# EAGLE board moteus_n1 (EAGLE 9.6.0)
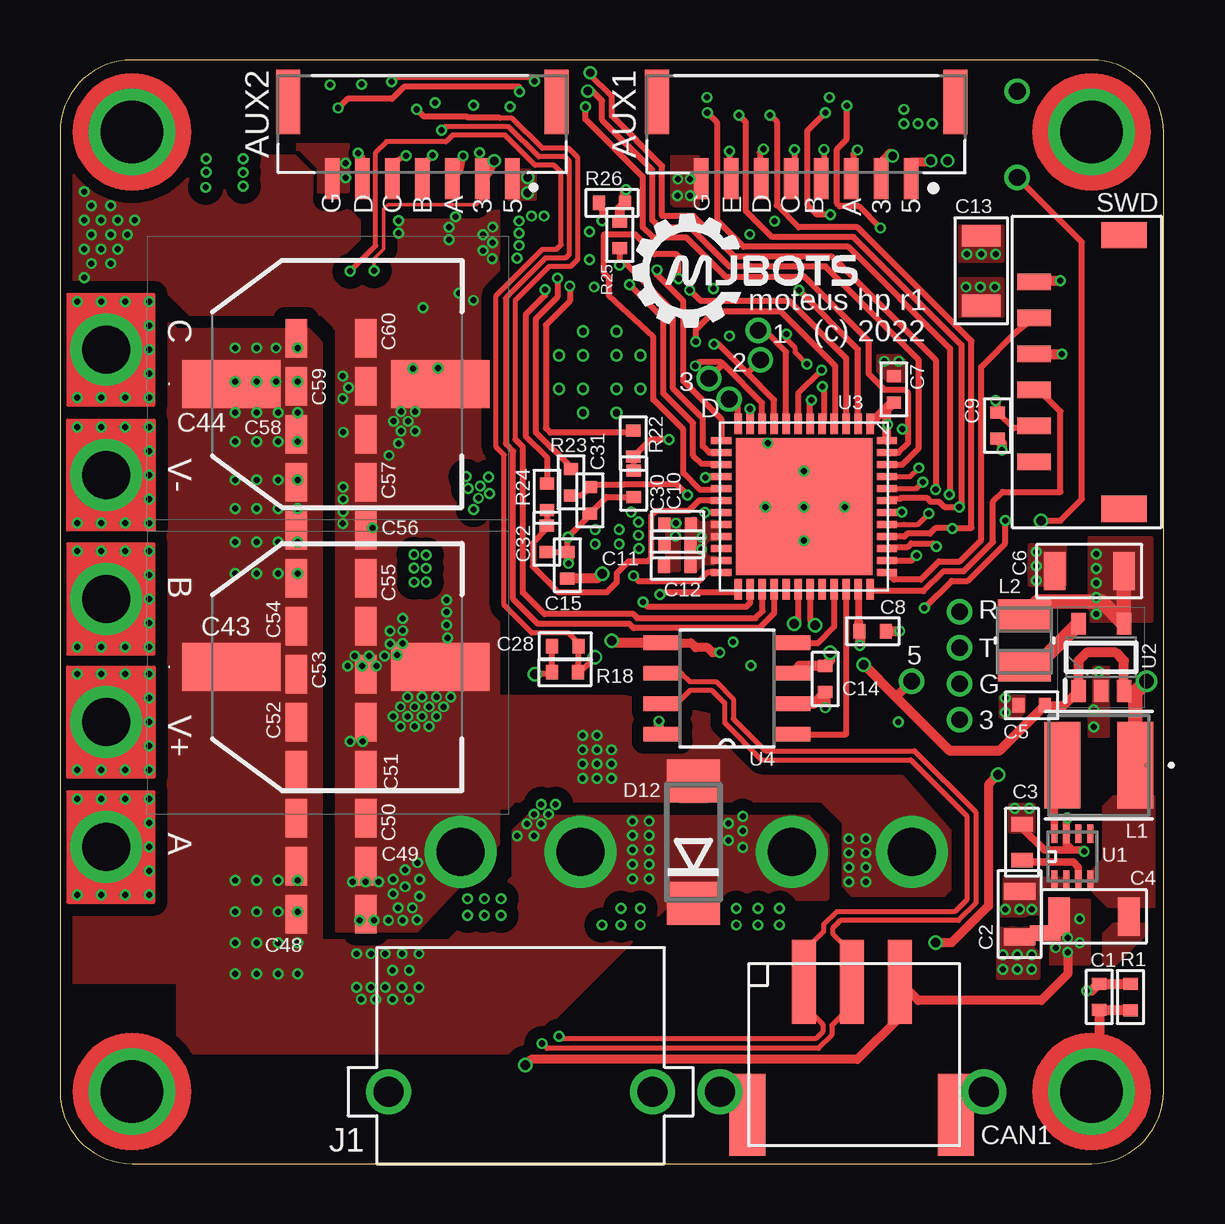
[diagram p9: board, top side]
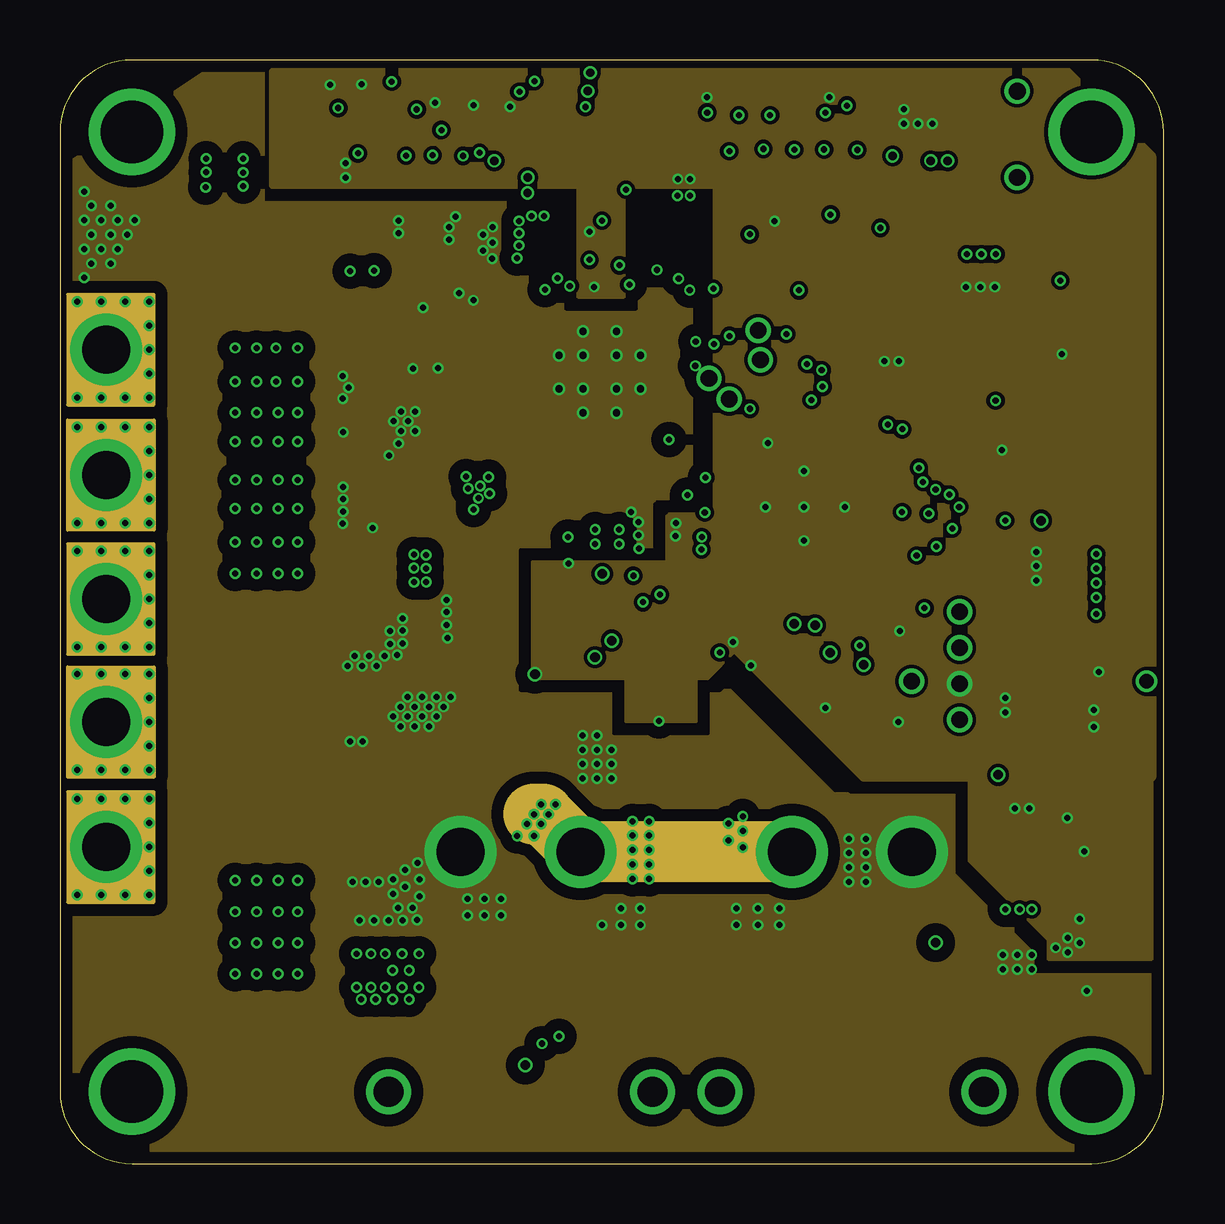
[diagram p10: board, inner layer Route2]
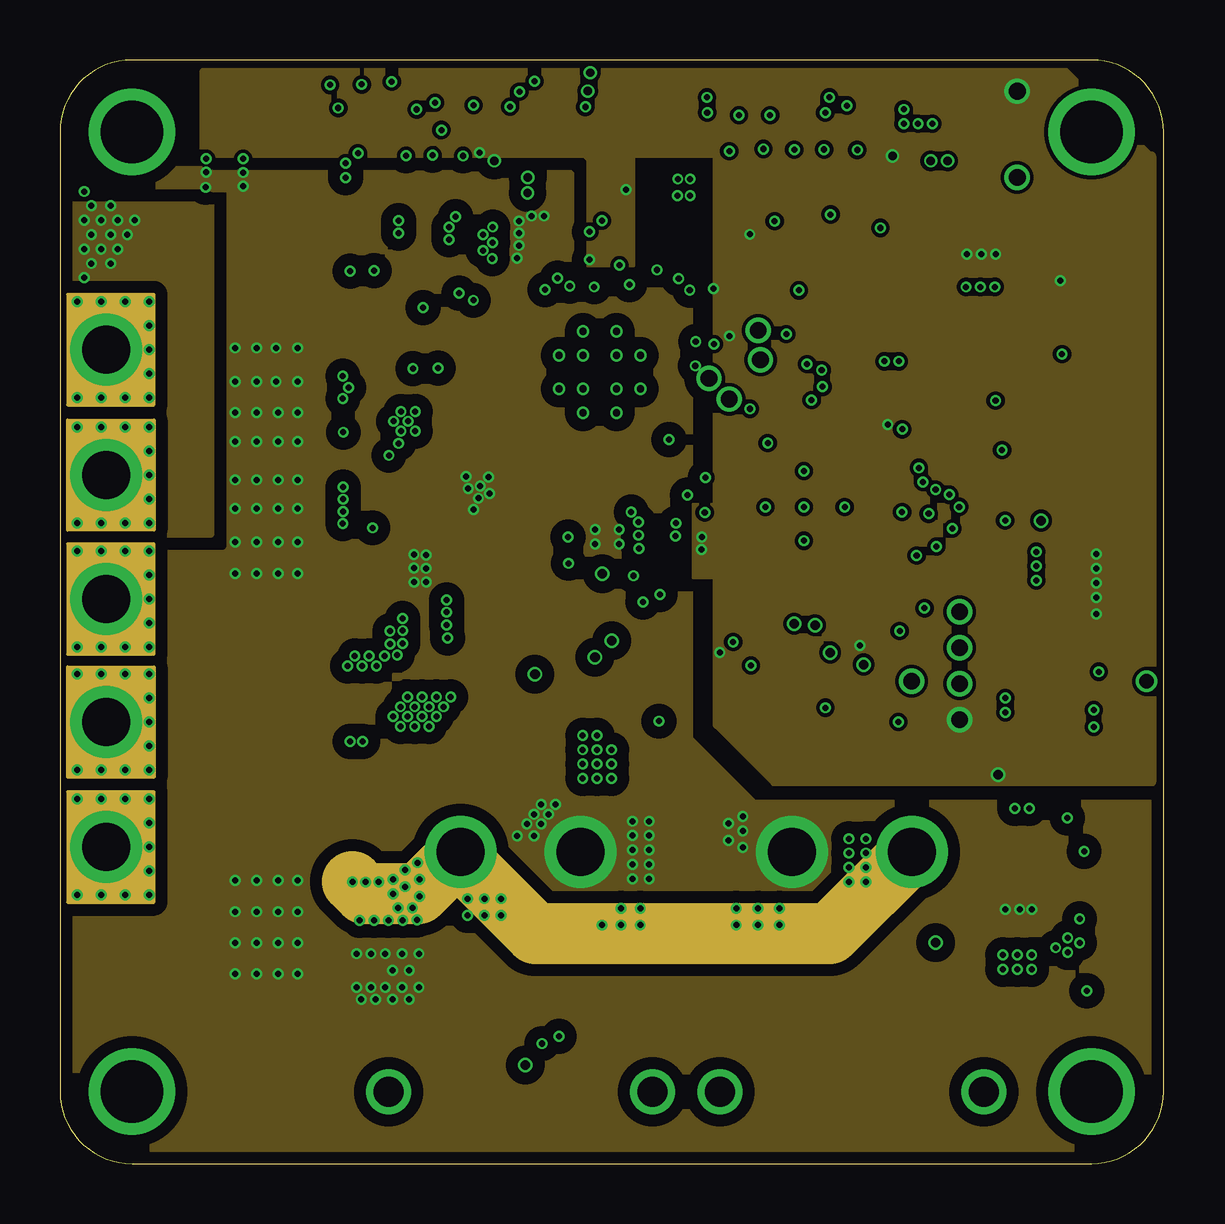
[diagram p11: board, inner layer Route15]
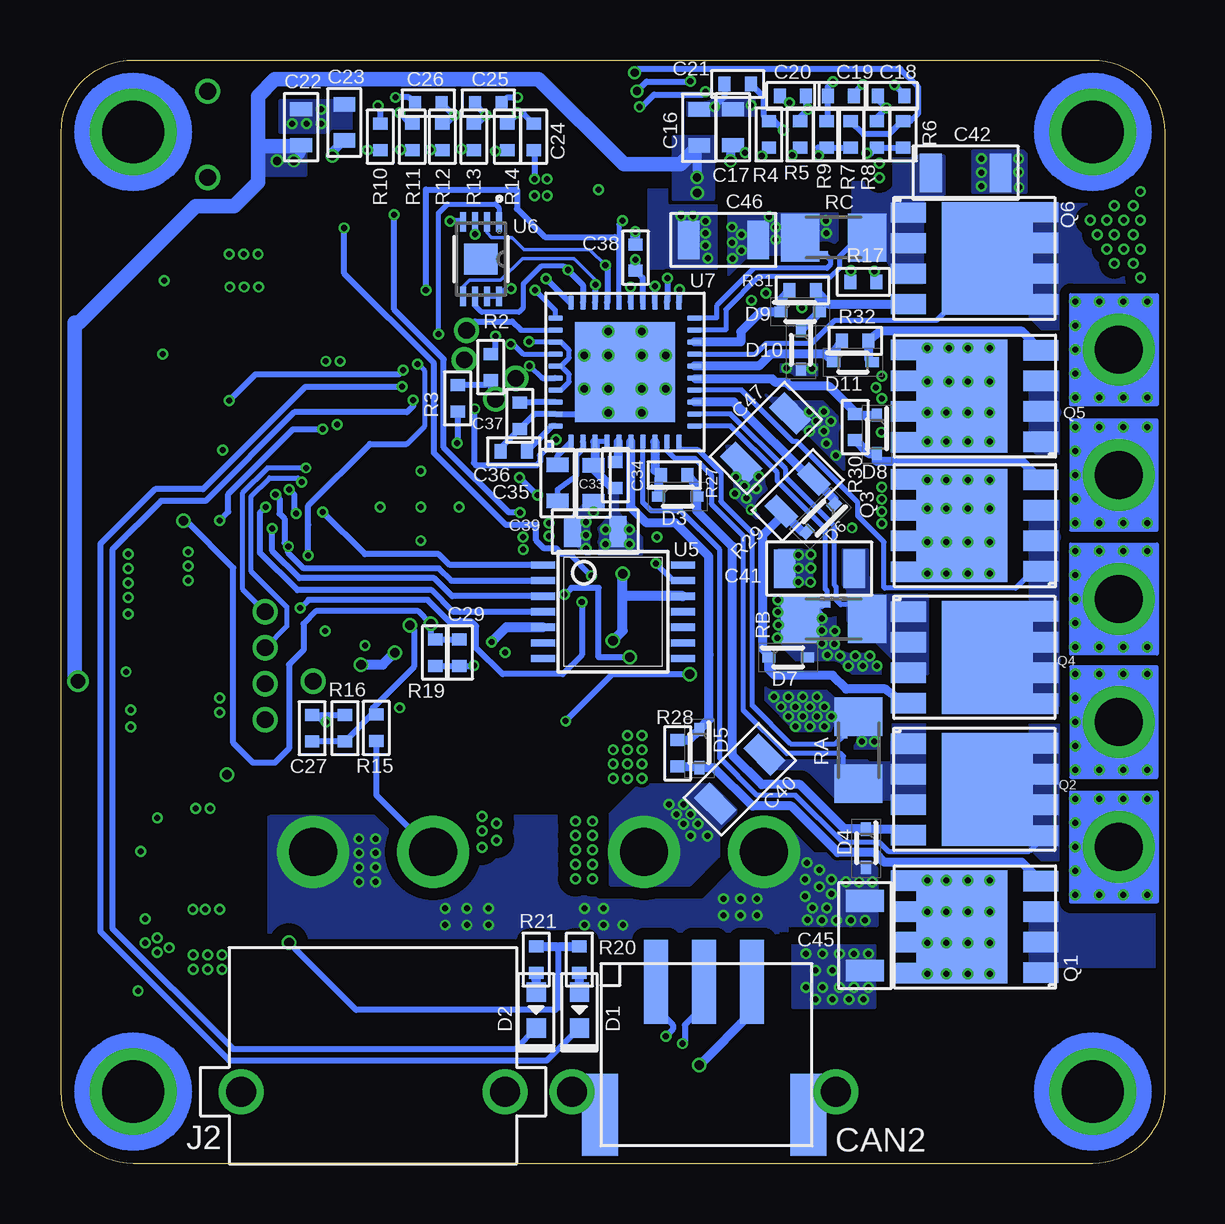
[diagram p12: board, bottom side, seen from below]

Size 46 x 46 mm. Coordinates in mm from the lower left corner, seen from the top.
Outline: 0,43 0,3 arc90 3,0 43,0 arc90 46,3 46,43 arc90 43,46 3,46 arc90 0,43
Copper layers (1*2*15*16): Top 0.035mm / dielectric 0.23mm / Route2 0.035mm / dielectric 0.93mm / Route15 0.035mm / dielectric 0.23mm / Bottom 0.035mm
Design rules "MF_4_mil_drill_4_Layer *": minimum track width 5mil, minimum drill 4mil, track to track 6mil, track to pad 6mil, pad to pad 6mil, via to via 6mil, smd to smd 0mil, copper to edge 10mil, drill to drill 10mil, minimum pad ring 4mil, minimum via ring 4mil, stop-mask expansion 2mil, vias tented up to drill 25mil, thermal gap 10mil
Net classes: 0 default: width 0.127 mm; 1 CAN: width 0.216 mm, clearance 0.127 mm; 2 HV: clearance 0.13 mm; 3 GATE: width 0.384 mm

## Footprints (pad centres in the part's own frame; a part is rotated, then mirrored left to right if it is on the bottom)
16AWG_TERM = drill 2: 1 0,0 | drill 0.254: 2 -2,1.8; 3 -2,0.8; 4 -2,-0.2; 5 -2,-1.2; 6 -1,1.8; 7 2,1.8; 8 1,1.8; 9 2,0.8; 10 2,-0.2; 11 2,-1.2; 12 0,1.8
JST_SM08B-GHS-TB(LF)(SN) = smd 0.6 x 1.7: 1 -4.375,0; 2 -3.125,0; 3 -1.875,0; 4 -0.625,0; 5 0.625,0; 6 1.875,0; 7 3.125,0; 8 4.375,0 | smd 1 x 2.7: SH1 -6.225,-3.2; SH2 6.225,-3.2
JST_SM07B-GHS-TB(LF)(SN) = smd 0.6 x 1.7: 1 -3.75,1.85; 2 -2.5,1.85; 3 -1.25,1.85; 4 0,1.85; 5 1.25,1.85; 6 2.5,1.85; 7 3.75,1.85 | smd 1 x 2.7: S1 5.6,-1.35; S2 -5.6,-1.35
C0402 = smd 0.5 x 0.6: P$1 -0.55,0; P$2 0.55,0
C0805 = smd 0.7 x 1.3: P$1 -0.95,0; P$2 0.95,0
C0603 = smd 0.6 x 0.9: P$1 -0.75,0; P$2 0.75,0
C1206 = smd 0.9 x 1.6: P$1 -1.45,0; P$2 1.45,0
EEHZS1V471UP = smd 4.1 x 2: 1 -4.35,0; 2 4.35,0
C1206_NOCREAM_NOBORDER = smd 0.9 x 1.6: P$1 -1.45,0; P$2 1.45,0
JST_S3B-PH-SM4-TB(LF)(SN) = smd 1 x 3.5: 1 2,-2.98; 2 0,-2.98; 3 -2,-2.98 | smd 1.5 x 3.4: S1 -4.35,2.57; S2 4.35,2.57
LED0603 = smd 0.8 x 0.8: ANODE 0.75,0; CATHODE -0.75,0
SODFL1608X70N = smd 0.55 x 0.42: 1 -0.8,0; 2 0.8,0
DO214AA = smd 1.8 x 2.2: A 2.55,0; C -2.55,0
24AWG_PAD = drill 0.7: P$1 0,0
XT30PW_MALE = drill 2: 1 -2.5,0; 2 2.5,0 | drill 1.25: M1 -5.5,10; M2 5.5,10
IND_BOURNS_SRN4018 = smd 1.499 x 3.607: 1 -1.524,0; 2 1.524,0
IND_4024100_WRE = smd 1.295 x 2.21: 1 -1.054,0; 2 1.054,0
M2.5MOUNT = drill 2.6: P$1 0,0
SOP_ADVANCE_8_VIAS = smd 0.85 x 1.45: 1 -1.905,-2.95; 2 -0.635,-2.95; 3 0.635,-2.95; 4 1.905,-2.95 | smd 0.85 x 1.1: 5 1.925,2.75; 6 0.637,2.75; 7 -0.637,2.75; 8 -1.925,2.75 | smd 4.7 x 3.8: PAD 0,0.35
SOP_ADVANCE_8 = smd 0.85 x 1.45: 1 -1.905,-2.95; 2 -0.635,-2.95; 3 0.635,-2.95; 4 1.905,-2.95 | smd 0.85 x 1.1: 5 1.925,2.75; 6 0.637,2.75; 7 -0.637,2.75; 8 -1.925,2.75 | smd 4.7 x 3.8: PAD 0,0.35
R0402 = smd 0.5 x 0.6: P$1 -0.55,0; P$2 0.55,0
R0805 = smd 0.7 x 1.3: P$1 -0.95,0; P$2 0.95,0
M1206 = smd 1.6 x 2: 1 -1.4,0; 2 1.4,0
SHORT_TOP-50 = smd 0.254 x 0.254: 1 0.127,0; 2 -0.127,0
SHORT_TOP-MEDIUM = smd 0.635 x 0.635: 1 0.318,0; 2 -0.318,0
JST_S6B-ZR-SM4A-TF(LF)(SN) = smd 0.7 x 1.4: 1 3.75,0; 2 2.25,0; 3 0.75,0; 4 -0.75,0; 5 -2.25,0; 6 -3.75,0 | smd 1.1 x 1.9: P1 5.7,3.75; P2 -5.7,3.75
21-0487A_MXM = smd 0.762 x 0.254: 1 -0.953,0.75; 2 -0.953,0.25; 3 -0.953,-0.25; 4 -0.953,-0.75; 5 0.953,-0.75; 6 0.953,-0.25; 7 0.953,0.25; 8 0.953,0.75
SOT95P280X130-5N = smd 0.9 x 0.6: 1 -1.4,0.95; 2 -1.4,0; 3 -1.4,-0.95; 4 1.4,-0.95; 5 1.4,0.95
QFN50P700X700X60-49N = smd 0.85 x 0.3: 1 -3.45,2.75; 2 -3.45,2.25; 3 -3.45,1.75; 4 -3.45,1.25; 5 -3.45,0.75; 6 -3.45,0.25; 7 -3.45,-0.25; 8 -3.45,-0.75; 9 -3.45,-1.25; 10 -3.45,-1.75; 11 -3.45,-2.25; 12 -3.45,-2.75; 25 3.45,-2.75; 26 3.45,-2.25; 27 3.45,-1.75; 28 3.45,-1.25; 29 3.45,-0.75; 30 3.45,-0.25; 31 3.45,0.25; 32 3.45,0.75; 33 3.45,1.25; 34 3.45,1.75; 35 3.45,2.25; 36 3.45,2.75 | smd 0.3 x 0.85: 13 -2.75,-3.45; 14 -2.25,-3.45; 15 -1.75,-3.45; 16 -1.25,-3.45; 17 -0.75,-3.45; 18 -0.25,-3.45; 19 0.25,-3.45; 20 0.75,-3.45; 21 1.25,-3.45; 22 1.75,-3.45; 23 2.25,-3.45; 24 2.75,-3.45; 37 2.75,3.45; 38 2.25,3.45; 39 1.75,3.45; 40 1.25,3.45; 41 0.75,3.45; 42 0.25,3.45; 43 -0.25,3.45; 44 -0.75,3.45; 45 -1.25,3.45; 46 -1.75,3.45; 47 -2.25,3.45; 48 -2.75,3.45 | smd 5.7 x 5.7: 49 0,0
SOIC8 = smd 1.549 x 0.61: 1 -2.7,1.905; 2 -2.7,0.635; 3 -2.7,-0.635; 4 -2.7,-1.905; 5 2.7,-1.905; 6 2.7,-0.635; 7 2.7,0.635; 8 2.7,1.905
TSSOP14 = smd 0.305 x 0.991: 1 -1.95,-2.918; 2 -1.3,-2.918; 3 -0.65,-2.918; 4 0,-2.918; 5 0.65,-2.918; 6 1.3,-2.918; 7 1.95,-2.918; 8 1.95,2.918; 9 1.3,2.918; 10 0.65,2.918; 11 0,2.918; 12 -0.65,2.918; 13 -1.3,2.918; 14 -1.95,2.918
UDFN8_2X3_ONS-M = smd 0.813 x 0.254: 1 -1.549,0.75; 2 -1.549,0.25; 3 -1.549,-0.25; 4 -1.549,-0.75; 5 1.549,-0.75; 6 1.549,-0.25; 7 1.549,0.25; 8 1.549,0.75 | smd 1.295 x 1.397: 9 0,0
WQFN-40 = smd 0.22 x 0.6: 1 2.25,2.9; 2 1.75,2.9; 3 1.25,2.9; 4 0.75,2.9; 5 0.25,2.9; 6 -0.25,2.9; 7 -0.75,2.9; 8 -1.25,2.9; 9 -1.75,2.9; 10 -2.25,2.9; 21 -2.25,-2.9; 22 -1.75,-2.9; 23 -1.25,-2.9; 24 -0.75,-2.9; 25 -0.25,-2.9; 26 0.25,-2.9; 27 0.75,-2.9; 28 1.25,-2.9; 29 1.75,-2.9; 30 2.25,-2.9 | smd 0.6 x 0.22: 11 -2.9,2.25; 12 -2.9,1.75; 13 -2.9,1.25; 14 -2.9,0.75; 15 -2.9,0.25; 16 -2.9,-0.25; 17 -2.9,-0.75; 18 -2.9,-1.25; 19 -2.9,-1.75; 20 -2.9,-2.25; 31 2.9,-2.25; 32 2.9,-1.75; 33 2.9,-1.25; 34 2.9,-0.75; 35 2.9,-0.25; 36 2.9,0.25; 37 2.9,0.75; 38 2.9,1.25; 39 2.9,1.75; 40 2.9,2.25 | drill 0.305: P1 -0.7,-1.7; P2 0.7,-1.7; P3 1.7,-0.7; P7 0.7,-0.7; P8 0.7,1.7; P9 -0.7,1.7; P12 -0.7,-0.7; P13 0.7,0.7; P14 -0.7,0.7; P17 -1.7,-0.7; P18 1.7,0.7; P19 -1.7,0.7 | smd 4.15 x 4.15: PAD 0,0

## Placement (x,y rotation side)
A  PAD16AWG_TERM  [16AWG_TERM]  1.92,13.19 90 bottom
AUX1  SM08B-GHS-TB(LF)(SN)  [JST_SM08B-GHS-TB(LF)(SN)]  31.1,41.05 180 top
AUX2  SM07B-GHS-TB(LF)(SN)  [JST_SM07B-GHS-TB(LF)(SN)]  15.1,42.9 180 top
B  PAD16AWG_TERM  [16AWG_TERM]  1.92,23.53 90 bottom
C  PAD16AWG_TERM  [16AWG_TERM]  1.92,33.92 90 bottom
C1  DNP  [C0402]  43.32,6.95 90 top
C2  1uF 100V  [C0805]  40,10.4 270 top
C3  1uF  [C0603]  40.1,13.4 90 top
C4  10uF  [C1206]  43.1,10.3 180 top
C5  1uF  [C0402]  40.5,19.1 180 top
C6  22uF  [C1206]  42.9,24.7 180 top
C7  0.1uF  [C0402]  34.76,32.27 90 top
C8  0.1uF  [C0402]  33.88,22.19 0 top
C9  0.1uF  [C0402]  39.08,30.76 270 top
C10  1uF  [C0402]  25.75,26.62 180 top
C11  0.1uF  [C0402]  25.74,25.82 180 top
C12  0.1uF  [C0402]  25.73,24.92 180 top
C13  10uF  [C1206]  38.4,37.21 90 top
C14  0.1uF  [C0402]  31.9,20.2 270 top
C15  0.1uF  [C0402]  21.15,24.94 90 top
C16  1uF  [C0603]  19.41,43.18 90 bottom
C17  1uF  [C0603]  18,43.2 90 bottom
C18  DNP  [C0402]  11.4,44.5 0 bottom
C19  DNP  [C0402]  13.5,44.5 0 bottom
C20  DNP  [C0402]  15.5,44.5 180 bottom
C21  DNP  [C0402]  17.8,45 180 bottom
C22  1uF  [C0603]  36,43.2 90 bottom
C23  1uF  [C0603]  34.2,43.4 90 bottom
C24  DNP  [C0402]  26.3,42.8 270 bottom
C25  DNP  [C0402]  28.2,44.2 0 bottom
C26  DNP  [C0402]  30.7,44.2 180 bottom
C27  0.01uF  [C0402]  35.54,18.15 90 bottom
C28  0.1uF  [C0402]  21.06,21.56 180 top
C29  0.1uF  [C0402]  29.4,21.3 270 bottom
C30  1000pF  [C0402]  23.91,28.34 270 top
C31  1000pF  [C0402]  22.09,27.65 270 top
C32  1000pF  [C0402]  20.29,26.04 270 top
C33  0.1uF 100V  [C0603]  23.81,28.35 270 bottom
C34  1uF  [C0402]  22.9,28.7 90 bottom
C35  0.1uF 100V  [C0603]  25.31,28.37 90 bottom
C36  1uF  [C0402]  27.13,29.69 0 bottom
C37  1uF  [C0402]  26.89,31.17 90 bottom
C38  0.1uF  [C0402]  22.06,37.76 270 bottom
C39  0.47uF 100V  [C0805]  23.74,26.34 180 bottom
C40  0.1uF 100V  [C1206]  17.71,16.02 45 bottom
C41  0.1uF 100V  [C1206]  14.4,24.8 0 bottom
C42  0.1uF 100V  [C1206]  8.3,41.3 180 bottom
C43  100uF 63V  [EEHZS1V471UP]  11.5,20.7 0 top
C44  100uF 63V  [EEHZS1V471UP]  11.5,32.5 0 top
C45  4.7uF 100V  [C1206]  12.5,9.5 90 bottom
C46  4.7uF 100V  [C1206]  18.4,38.5 0 bottom
C47  4.7uF 100V  [C1206]  16.63,30.24 45 bottom
C48  4.7uF 100V  [C1206_NOCREAM_NOBORDER]  11.3,10.4 0 top
C49  4.7uF 100V  [C1206_NOCREAM_NOBORDER]  11.3,12.4 0 top
C50  4.7uF 100V  [C1206_NOCREAM_NOBORDER]  11.3,14.4 0 top
C51  4.7uF 100V  [C1206_NOCREAM_NOBORDER]  11.3,16.4 0 top
C52  4.7uF 100V  [C1206_NOCREAM_NOBORDER]  11.3,18.4 0 top
C53  4.7uF 100V  [C1206_NOCREAM_NOBORDER]  11.3,20.4 0 top
C54  4.7uF 100V  [C1206_NOCREAM_NOBORDER]  11.3,22.4 0 top
C55  4.7uF 100V  [C1206_NOCREAM_NOBORDER]  11.3,24.4 0 top
C56  4.7uF 100V  [C1206_NOCREAM_NOBORDER]  11.3,26.4 0 top
C57  4.7uF 100V  [C1206_NOCREAM_NOBORDER]  11.3,28.4 0 top
C58  4.7uF 100V  [C1206_NOCREAM_NOBORDER]  11.3,30.4 0 top
C59  4.7uF 100V  [C1206_NOCREAM_NOBORDER]  11.3,32.4 0 top
C60  4.7uF 100V  [C1206_NOCREAM_NOBORDER]  11.3,34.4 0 top
CAN1  JST-PH3  [JST_S3B-PH-SM4-TB(LF)(SN)]  33,4.6 180 top
CAN2  JST-PH3  [JST_S3B-PH-SM4-TB(LF)(SN)]  19.2,4.6 180 bottom
D1  MF-LED-0603-RED  [LED0603]  24.4,6.4 90 bottom
D2  MF-LED-0603-RED  [LED0603]  26.2,6.4 90 bottom
D3  BAT41KFILM  [SODFL1608X70N]  20.3,27.8 0 bottom
D4  BAT41KFILM  [SODFL1608X70N]  12.45,13.14 270 bottom
D5  BAT41KFILM  [SODFL1608X70N]  19.4,17.3 270 bottom
D6  BAT41KFILM  [SODFL1608X70N]  14.35,26.9 225 bottom
D7  BAT41KFILM  [SODFL1608X70N]  15.7,21.1 0 bottom
D8  BAT41KFILM  [SODFL1608X70N]  12,30.4 270 bottom
D9  BAT41KFILM  [SODFL1608X70N]  15.2,35.5 0 bottom
D10  BAT41KFILM  [SODFL1608X70N]  15.17,33.92 270 bottom
D11  BAT41KFILM  [SODFL1608X70N]  13,33.4 0 bottom
D12  [DO214AA]  26.4,13.4 90 top
D33  PAD24AWG_PAD  [24AWG_PAD]  37.5,18.5 0 top
D50  PAD24AWG_PAD  [24AWG_PAD]  35.5,20.1 0 top
DAC  PAD24AWG_PAD  [24AWG_PAD]  27.9,31.86 0 top
DG1  PAD24AWG_PAD  [24AWG_PAD]  37.5,20 0 top
DTR  PAD24AWG_PAD  [24AWG_PAD]  37.5,23 0 top
DTX  PAD24AWG_PAD  [24AWG_PAD]  37.5,21.5 0 top
J1  XT30XT30PW_MALE  [XT30PW_MALE]  19.2,13 180 top
J2  XT30XT30PW_MALE  [XT30PW_MALE]  33,13 180 bottom
L1  SRN4018-220M  [IND_BOURNS_SRN4018]  43.3,16.6 180 top
L2  74404024100  [IND_4024100_WRE]  40.2,21.8 270 top
M1  MOUNT  [M2.5MOUNT]  3,3 0 top
M2  MOUNT  [M2.5MOUNT]  3,43 0 top
M3  MOUNT  [M2.5MOUNT]  43,3 0 top
M4  MOUNT  [M2.5MOUNT]  43,43 0 top
MOT1  PAD24AWG_PAD  [24AWG_PAD]  29.1,34.73 0 top
MOT2  PAD24AWG_PAD  [24AWG_PAD]  29.2,33.5 0 top
MOT3  PAD24AWG_PAD  [24AWG_PAD]  27.05,32.73 0 top
Q1  TPH1R204PL_VIAS  [SOP_ADVANCE_8_VIAS]  8.11,9.86 90 bottom
Q2  TPH1R204PLSOP_ADVANCE_8  [SOP_ADVANCE_8]  7.74,15.6 270 bottom
Q3  TPH1R204PL_VIAS  [SOP_ADVANCE_8_VIAS]  8.11,26.59 90 bottom
Q4  TPH1R204PLSOP_ADVANCE_8  [SOP_ADVANCE_8]  7.74,21.1 270 bottom
Q5  TPH1R204PL_VIAS  [SOP_ADVANCE_8_VIAS]  8.11,31.99 90 bottom
Q6  TPH1R204PLSOP_ADVANCE_8  [SOP_ADVANCE_8]  7.74,37.73 270 bottom
R1  DNP  [R0402]  44.62,6.94 90 top
R2  DNP  [R0402]  28.1,33.2 90 bottom
R3  100k 1%  [R0402]  29.47,31.9 90 bottom
R4  100  [R0402]  16.5,42.9 90 bottom
R5  100  [R0402]  15.2,42.9 90 bottom
R6  2k  [R0402]  10.9,42.9 270 bottom
R7  2k  [R0402]  13.1,42.9 270 bottom
R8  100  [R0402]  12,42.9 90 bottom
R9  100  [R0402]  14.1,42.9 90 bottom
R10  100  [R0402]  32.7,42.8 90 bottom
R11  100  [R0402]  31.37,42.8 90 bottom
R12  100  [R0402]  30.11,42.8 90 bottom
R13  100  [R0402]  28.8,42.8 90 bottom
R14  100  [R0402]  27.4,42.8 90 bottom
R15  100k 1%  [R0402]  32.87,18.16 270 bottom
R16  4.7k 1%  [R0402]  34.17,18.15 270 bottom
R17  47k NTC  [R0402]  12.56,36.75 0 bottom
R18  10k 1%  [R0402]  21.05,20.48 180 top
R19  10k 1%  [R0402]  30.4,21.3 270 bottom
R20  560  [R0402]  24.4,8.5 270 bottom
R21  560  [R0402]  26.2,8.5 270 bottom
R22  22  [R0402]  23.9,30.01 270 top
R23  22  [R0402]  21.3,28.4 270 top
R24  22  [R0402]  20.3,27.79 270 top
R25  2k  [R0402]  23.34,38.71 270 top
R26  2k  [R0402]  23.01,40.04 180 top
R27  7.5  [R0402]  20.45,28.7 0 bottom
R28  7.5  [R0402]  20.3,17.1 270 bottom
R29  7.5  [R0805]  15.3,27.86 225 bottom
R30  7.5  [R0402]  12.9,30.7 270 bottom
R31  7.5  [R0402]  15.1,36.4 0 bottom
R32  7.5  [R0402]  12.9,34.3 0 bottom
RA  0.5mOhm 1% 2W  [M1206]  12.76,17.23 270 bottom
RB  0.5mOhm 1% 2W  [M1206]  13.8,22.7 0 bottom
RC  0.5mOhm 1% 2W  [M1206]  13.8,38.6 0 bottom
SH1  SHORTT5  [SHORT_TOP-50]  13.36,17.98 270 bottom
SH2  SHORTT5  [SHORT_TOP-50]  14.2,23.3 0 bottom
SH3  SHORTT5  [SHORT_TOP-50]  14.3,37.9 0 bottom
SH4  SHORTMEDIUM  [SHORT_TOP-MEDIUM]  41.06,9.6 180 top
SWD  JST-ZH6  [JST_S6B-ZR-SM4A-TF(LF)(SN)]  40.6,33 270 top
TEMP1  PAD24AWG_PAD  [24AWG_PAD]  39.9,44.7 0 top
TEMP2  PAD24AWG_PAD  [24AWG_PAD]  39.9,41.1 0 top
U1  MAX15062AATA+T  [21-0487A_MXM]  42.2,12.8 90 top
U2  XC9265A331MR-G  [SOT95P280X130-5N]  43.4,21.1 90 top
U3  STM32G474CEU6  [QFN50P700X700X60-49N]  31.02,27.38 270 top
U4  TCAN1042HGV  [SOIC8]  27.8,19.8 180 top
U5  AS5147  [TSSOP14]  23,23 270 bottom
U6  CAT25080HU4I-GT3UDFN8_2X3_ONS-M  [UDFN8_2X3_ONS-M]  28.5,37.7 270 bottom
U7  DRV8353S  [WQFN-40]  22.5,32.99 180 bottom
VN  PAD16AWG_TERM  [16AWG_TERM]  1.92,28.7 270 top
VP  PAD16AWG_TERM  [16AWG_TERM]  1.92,18.4 270 top

## Tracks (layer width: path | path; a pad name or v marks a point on that pad's centre or on a via)
+3V3  (via drill 0.25, 0.35, 0.4)
  Top 0.152: AUX2.2 17.6,40.2 17.37,39.97 13.67,39.97 13.49,39.79 13.49,38.12 13.09,37.72 v13.09,37.22
  Top 0.254: U3.35 33.29,23.93
  Top 0.3: 33.29,23.93 33.29,22.57
  Top 0.35: U3.48 34.47,30.77
  Top 0.384: U3.1 34.66,31.72 C7.P$1 34.47,31.43 U3.48 | 33.29,22.57 C8.P$1 | v34.7,42 34.58,42.1 34.23,41.7 AUX1.2 | v18.1,41.8 17.81,41.26 AUX2.2 | v39.1,16.2 38.7,15.8 38.7,10.74 37.16,9.2 v36.5,9.2 | U4.5 26.3,21.7 26.5,21.5 27,21.5 27.2,21.3 v27.5,21.3
  Top 0.406: C8.P$1 v33.34,21.6 | SWD.6 40.65,36.8 v41.7,36.8 | 34.47,30.77 v34.5,30.8 | v23.6,40.6 23.56,40.56 R26.P$1 23.34,39.82 R25.P$1 | U4.5 23.09,21.7 v23,21.8 | C15.P$1 22.4,24.39 v22.6,24.59
  Top 0.61: L2.1 40.77,23.42 43.43,23.42 U2.4 C6.P$1
  Bottom 0.152: v13.09,37.22 13.11,37.2 R17.P$1
  Bottom 0.254: U7.24 21.76,36.91 C38.P$2 | R2.P$2 27.9,33.95 v27.9,34.5 | v27.24,36.47 27.43,36.47 U6.8 U6.7 | U6.3 v28.75,38.73 | 25.3,9 25.3,6.5 25.4,6.4 33.7,6.4 v36.5,9.2
  Bottom 0.305: C17.P$1 17.81,42.45 v17.49,42.13
  Bottom 0.384: C23.P$1 34.7,42.15 v34.7,42 | C17.P$1 18.1,42.35 v18.1,41.8 | R21.P$1 25.38,9.05 25.3,9 25.22,9.05 R20.P$1
  Bottom 0.406: C38.P$2 v22.06,37.66 v22.07,37.67 | v23,21.8 22.6,22.2 22.6,23.6 | 22.6,23.6 v22.6,24.59 | U5.12 22.55,23.65 22.6,23.6
  other vias: 43.2,25.4 43.2,24.8 43.2,24.2 43.2,23.6 43.2,22.9 37.8,37.9 38.4,37.9 39,37.9 26.75,26.11 26.74,25.6
  pour Route15 (no thermals): 6,45.5 41.9,45.5 45.4,42 45.5,42 45.5,15.9 29.8,15.9 27.4,18.3 27.4,42.1 6,42.1
  pour Top (no thermals): 42.9,26.1 45.5,26.1 45.5,22.6 42.9,22.6
  pour Top (no thermals): 37.5,39.1 39.3,39.1 39.3,37.6 37.5,37.6
  pour Route15 (no thermals): 21.5,42.3 23.9,42.3 23.9,37.4 22,37.4 22,41.8
  pour Top (no thermals): 26.1,26.9 27.4,26.9 27.4,26 27,26 27,25.3 27.3,25.3 27.3,25 26.8,25 26.5,24.7 26.1,24.7
  pour Route15 (no thermals): 26.4,27.5 27.9,27.5 27.9,24.4 26.4,24.4
+5V  (via drill 0.35, 0.4, 0.6)
  Top 0.384: v36.3,41.8 36.25,41.75 35.5,41.75 35.48,41.7 AUX1.1 | C5.P$1 41.85,19.1 U2.1 | 34.85,19.45 D50.P$1
  Top 0.406: L1.1 44.82,19.23 U2.3 44.35,20.95 44,21.3 42.8,21.3 42.45,20.95 U2.1 | U4.3 30.82,20.75 C14.P$1 32.1,20.95 v32.1,21.3 | C5.P$1 39.15,17.2 37.1,17.2 34.85,19.45 v33.5,20.8
  Top 0.61: L1.1 44.82,19.63 v45.3,20.1
  Bottom 0.384: C22.P$1 36,42.1 v36.3,41.8 | C16.P$1 19.5,42.34 v19.5,41.1
  Bottom 0.406: v33.5,20.8 32.6,20.8 v32.1,21.3
  Bottom 0.61: v45.3,20.1 45.44,20.25 45.44,35.06 45.24,35.06 40.4,39.9 38.8,39.9 37.8,40.9 37.8,42.4 | 37.8,42.4 37.8,44.5 37.1,45.2 26.1,45.2 22.55,41.65 20.19,41.65 C16.P$1 | C22.P$1 36.05,42.4 37.8,42.4
  other vias: 37,41.8 19.49,40.46
  pour Top (no thermals): 43.9,15.3 45.6,15.3 45.6,10.7 43.7,10.7 42.9,11.5 42.9,12.1 43.5,12.7 43.5,14.9
  pour Top (no thermals): 43.9,10 45.3,10 45.3,9.6 44,8.3 43.5,8.3 43.5,9.6
  pour Bottom (no thermals): 35.8,42.5 37.8,42.5 37.8,41.2 35.8,41.2
  pour Bottom (no thermals): 18.8,42.8 20.5,42.8 20.5,40.2 18.8,40.2
  pour Top (no thermals): 18.7,41.4 19.8,41.4 19.8,40.2 18.7,40.2
AS5047_CS  (via drill 0.25)
  Top 0.254: v35.1,27.16 35.07,27.13 U3.42
  Bottom 0.254: U5.1 29.81,24.95 30.26,25.4 33.34,25.4 v35.1,27.16
AS5047_MISO  (via drill 0.25)
  Top 0.254: v29.6,43.7 29.88,43.42 29.88,39.94 30.79,39.03 33.25,39.03 37.99,34.29 37.99,26.5 37.2,26.5 v37.2,26.47 37.19,26.48 36.49,26.48 36.27,26.26 35.32,26.26 35.19,26.13 U3.40
  Bottom 0.254: U5.3 29.7,23.65 30.45,24.4 36.06,24.4 37.2,25.54 v37.2,26.47 | R12.P$2 29.95,43.35 v29.6,43.7 29.65,43.7 C26.P$1
AS5047_MOSI  (via drill 0.25)
  Top 0.254: v28.3,43.7 28.58,43.42 28.58,39.72 29.68,38.62 33.08,38.62 37.58,34.12 37.58,27.47 v37.48,27.37 36.86,27.37 36.64,27.59 36.29,27.59 36.13,27.75 35.06,27.75 35.01,27.7 34.54,27.7 U3.43
  Bottom 0.254: U5.4 29.66,23 30.56,23.9 36.15,23.9 37.72,25.47 37.72,27.13 v37.48,27.37 | R13.P$2 28.65,43.35 v28.3,43.7 28.75,44.15 C25.P$1
AS5047_SCK  (via drill 0.25)
  Top 0.254: v37.07,27.88 37.1,27.91 37.1,33.97 32.86,38.21 28.49,38.21 27.38,39.32 27.38,43.41 v26.98,43.81 | U3.39 34.54,25.7 35.34,25.7 35.49,25.85 36.4,25.85 v36.53,25.72
  Bottom 0.254: U5.2 29.73,24.29 30.25,24.81 35.89,24.81 36.53,25.45 v36.53,25.72 36.69,25.88 36.69,26.88 36.9,27.09 36.9,27.71 v37.07,27.88 | v26.98,43.81 26.98,43.77 | 26.98,43.77 R14.P$2 | C24.P$1 26.72,43.77 26.98,43.77
AUX_SC1  (via drill 0.25)
  Top 0.2: 18.99,30.18 18.99,35.99 20.4,37.4 21.3,37.4 21.59,37.69 21.59,41.93 21.2,42.32 20.11,42.32 18.85,43.57 18.33,43.57 18.3,43.6
  Top 0.254: 18.3,43.6 17,43.6 16.96,43.64 15.17,43.64 v14.87,43.94 | 18.99,30.18 19.3,29.86 19.3,23.8 20.2,22.9 23.9,22.9 24.07,22.73 28.99,22.73 29.28,23.02 29.28,23.92 U3.27
  Bottom 0.254: R5.P$2 15.2,43.61 v14.87,43.94 14.95,44.02 C20.P$1
AUX_SC2  (via drill 0.25)
  Top 0.2: v15.9,43.08 16.04,43.22 18.71,43.22 19.96,41.97 21.05,41.97 21.24,41.78 21.24,37.9 21.09,37.75 20.25,37.75 18.57,36.07 18.57,30.02 18.61,29.98
  Top 0.254: U3.28 29.77,22.93 29.16,22.32 23.91,22.32 23.73,22.49 19.93,22.49 18.89,23.53 18.89,29.7 18.61,29.98
  Bottom 0.254: v15.9,43.08 16.27,43.45 R4.P$2 16.7,43.65 16.7,44.45 C21.P$1
AUX_SCL  (via drill 0.25, 0.35)
  Top 0.254: U3.46 35.11,29.13 35.8,29.82 35.8,33.5 31.91,37.39 27.9,37.39 26.28,39.01 25,39.01 24.69,39.32 24.69,41.41 22.6,43.5 22.6,44.3 22.2,44.7 v22,44.7 | v13.83,45.09 13.82,45.12 13.99,45.28 19.61,45.28 v19.78,45.11
  Bottom 0.254: v22,44.7 21.6,45.1 v19.79,45.1 v19.78,45.11 | R9.P$2 14.05,43.5 C19.P$1 14.05,44.87 v13.83,45.09
AUX_SDA  (via drill 0.25)
  Top 0.254: U3.47 34.96,29.63 35.36,30.04 35.36,30.6 | 35.36,30.6 35.36,32.11 35.21,32.26 34.37,32.26 33.7,32.92 33.7,34.3 31.03,36.97 27.73,36.97 26.09,38.61 24.71,38.61 24.29,39.03 24.29,41.14 21.9,43.53 v21.9,44.04 | v11.6,44 11.98,44.38 13.84,44.38 14.33,44.88 19.15,44.88 v19.15,44.68 | U3.26 28.77,23.37 28.6,23.2 24.5,23.2 v24.3,23.4 | v36.04,23.15 37.18,24.29 37.84,24.29 39.4,25.85 v39.4,26.8 | v35.11,30.61 35.35,30.61 35.36,30.6
  Bottom 0.254: R8.P$2 12,43.6 v11.6,44 11.95,44.35 C18.P$1 | v19.15,44.68 19.27,44.56 21.29,44.56 21.8,44.04 v21.9,44.04 | v24.3,23.4 24.3,21.2 25.1,20.4 27.6,20.4 28.7,21.5 28.7,22.4 28.89,22.59 29.82,22.59 30.73,23.49 35.69,23.49 v36.04,23.15 | v35.11,30.61 36.33,30.61 39.03,27.91 39.03,27.17 v39.4,26.8
CAN_N  (via drill 0.25)
  Top 0.216: U4.6 25.91,20.43 26.26,20.08 27.34,20.08 28.07,19.35 28.07,18.53 29.4,17.2 35.62,17.2 38.17,14.65 38.17,10.85 37.45,10.13 32.53,10.13 32.2,9.8 32.2,9.6 32.9,8.9 33,8.9 | CAN1.2 33,6.6 32.17,5.77 32.17,5.35 31.62,4.8 20.3,4.8 v20.1,5
  Top 0.384: 33,8.9 CAN1.2
  Bottom 0.254: CAN2.2 19.2,6.58 20,5.78 20,5.1 v20.1,5
CAN_P  (via drill 0.25)
  Top 0.216: U4.7 25.7,19.16 26.25,19.72 27.18,19.72 27.7,19.2 27.7,18.38 29.25,16.83 35.47,16.83 37.8,14.5 37.8,11 37.3,10.5 32.38,10.5 31.83,9.95 31.83,9.67 31,8.84 | 31,6.6 31.8,5.8 31.8,5.5 31.5,5.2 20.9,5.2 v20.8,5.3
  Top 0.384: 31,8.84 CAN1.1 31,6.6
  Bottom 0.254: CAN2.1 21.2,6.48 20.5,5.78 20.5,5.6 v20.8,5.3
CAN_RX
  Top 0.254: U3.33 32.27,22.37 31.61,21.7 U4.4
CAN_TX
  Top 0.254: U3.34 32.77,17.89 U4.1
CUR1  (via drill 0.25)
  Top 0.254: v21.25,36.58 21.25,35.95 20.25,34.95 20.25,30.65 20.44,30.46 23.8,30.46 R22.P$1
  Bottom 0.254: U7.23 v21.25,36.58
CUR2  (via drill 0.25)
  Top 0.254: v20.74,36.91 20.74,36.12 19.83,35.21 19.83,30.49 21.3,29.02 R23.P$1
  Bottom 0.254: U7.22 20.75,35.93 20.74,35.94 v20.74,36.91
CUR3  (via drill 0.25)
  Top 0.254: v20.22,36.43 20.22,36.19 19.41,35.38 19.41,30.33 20.3,29.44 R24.P$1
  Bottom 0.254: v20.22,36.43 v20.21,36.42 20.25,36.39 U7.21
DAC
  Top 0.254: U3.12 28.27,31.23 28.25,31.25 28.25,31.51 DAC.P$1
  Bottom 0.254: DAC.P$1 28.1,32.06 R2.P$1 28.3,32.45 R3.P$2
DEBUG_RX  (via drill 0.25)
  Top 0.2: U3.45 35.43,28.63 v35.8,29
  Bottom 0.2: v35.8,29 37.4,29 38.45,27.95 38.45,23.95 DTR.P$1
DEBUG_TX  (via drill 0.25)
  Top 0.2: U3.44 35.69,28.13 v35.97,28.41
  Bottom 0.2: DTX.P$1 36.6,22.4 36.6,23.2 38.1,24.7 38.1,27.8 37.32,28.58 36.14,28.58 v35.97,28.41
DRV8323_CS  (via drill 0.25)
  Top 0.254: v25.79,36.89 25.79,37.81 25.7,37.9 24.8,37.9 23.98,38.72 22.68,38.72 22.68,37.12 22.88,36.9 22.88,36.18 24.74,34.46 24.74,31.84 25.99,30.59 25.99,28.77 26.68,28.08 27.52,28.08 U3.17
  Bottom 0.254: U7.30 24.79,35.89 v25.79,36.89
DRV8323_MISO  (via drill 0.25)
  Top 0.254: 23.34,37.46 23.64,37.46 25.56,35.54 25.56,32.3 26.8,31.06 26.8,29.9 27.07,29.63 U3.14 | 23.34,37.46 v23.32,37.44 | 23.34,37.46 R25.P$2
  Bottom 0.152: v23.32,37.44 23.98,38.1 26.7,38.1 27.2,38.6 28.06,38.6 28.25,38.79 U6.2
  Bottom 0.254: v23.32,37.44 23.3,37.44 23.22,37.52 23.22,35.92 U7.27
DRV8323_MOSI  (via drill 0.25)
  Top 0.254: v23.73,36.63 25.15,35.22 25.15,32.1 26.39,30.86 26.39,29.52 26.75,29.16 27.54,29.16 U3.15
  Bottom 0.152: v23.73,36.63 23.73,36.83 24.63,37.73 26.77,37.73 27.68,36.82 28.98,36.82 29.25,36.55 U6.5
  Bottom 0.254: v23.73,36.63 23.75,36.62 U7.28
DRV8323_SCLK  (via drill 0.25)
  Top 0.254: v24.88,37.25 24.88,37.05 25.97,35.96 25.97,32.63 27.57,31.03 U3.13
  Bottom 0.2: v24.88,37.25 25.03,37.4 26,37.4 26.74,36.66 26.74,35.66 26.92,35.48 28.47,35.48 28.75,35.76 U6.6
  Bottom 0.254: v24.88,37.25 24.25,36.62 U7.29
EEPROM_CS  (via drill 0.25)
  Top 0.2: v31.14,33.32 30.65,33.81 30.65,33.98 30.28,34.36 v30.28,34.58
  Top 0.254: U3.38 35.49,25.13 v35.71,25.35
  Bottom 0.2: 31.6,30 31.58,30 30.84,30.74 30.84,33.02 v31.14,33.32 | v30.28,34.58 30.28,39.62 29.9,40 27.9,40 27.75,39.85 U6.1
  Bottom 0.254: v35.71,25.35 35.71,26.62 35.7,26.63 35.7,27.43 33.13,30 31.6,30
FCUR1  (via drill 0.25)
  Top 0.254: U3.11 28.76,30.84 v28.76,31.46 | C30.P$1 R22.P$2 24.61,30.17 v25.38,30.17
  Bottom 0.254: v28.76,31.46 28.8,31.42 28.8,29.2 28.71,29.11 26.17,29.11 26.05,29.23 26.05,29.53 25.41,30.17 v25.38,30.17
FCUR2  (via drill 0.25)
  Top 0.254: U3.16 27.04,28.64 27,28.6 v26.9,28.6 | R23.P$2 21.74,27.85 C31.P$1 22.19,28.3 23.48,28.3 23.49,28.32 25.7,28.32 v26.15,27.87
  Bottom 0.254: v26.9,28.6 26.17,27.87 v26.15,27.87
FCUR3
  Top 0.254: R24.P$2 C32.P$1 20.29,26.44 19.71,25.86 19.71,24.89 20.57,24.03 20.57,24.02 20.79,23.81 22.78,23.81 23.2,24.22 23.2,24.6 23.7,25.1 24.5,25.1 24.64,25.24 24.64,27 24.83,27.2 26.2,27.2 26.64,27.64 27.09,27.64 27.1,27.63 U3.18
GHA
  Bottom 0.384: U7.6 22.25,27.35 21.6,26.7 20.4,26.7 19,25.3 19,21.2 19,18.5 D5.1 19.85,17.65 R28.P$1
GHA_D
  Bottom 0.37: 5.96,12.55 11.68,12.55 12.09,12.96 13.63,12.96
  Bottom 0.384: Q1.4 5.96,12.55 | 13.63,12.96 15.57,14.9 17.19,14.9 18.79,16.5 D5.2 19.45,16.55 R28.P$2
GHB
  Bottom 0.3: 19.56,32.7 U7.15
  Bottom 0.384: 19.56,32.7 16.36,32.7 16.22,32.56 15.76,32.56 15.6,32.4 14,32.4 12.9,31.3 R30.P$1 12.85,31.2 D8.1
GHB_D
  Bottom 0.384: Q3.4 5.96,29.29 12.04,29.29 12.04,29.56 D8.2 12.35,29.6 R30.P$2
GHC
  Bottom 0.384: R32.P$1 13.8,33.85 D11.1 14.14,33.74 16.43,33.74 16.93,33.24 U7.16
GHC_D
  Bottom 0.384: Q5.4 5.95,34.69 11.86,34.69 R32.P$2 12.35,33.55 D11.2
GLA
  Bottom 0.384: D3.1 21.1,28.55 R27.P$1 21.25,28.9 U7.8
GLA_D
  Bottom 0.384: Q2.4 10.71,13.7 11.12,13.87 11.05,13.94 D4.1 13.35,13.94 15.21,15.8 16.8,15.8 18.02,17.02 18.02,25.72 19.5,27.2 D3.2 19.5,28.25 R27.P$2
GLB
  Bottom 0.384: U7.13 17.97,31.74 14.63,28.4 R29.P$1 13.78,27.69 D6.1
GLB_D
  Bottom 0.384: D6.2 15.12,26.33 R29.P$2 15.97,26.98 16.75,26.2 16.75,21.45 16.5,21.2 D7.1 16.5,20.6 16.24,20.34 13.84,20.34 13.27,19.77 11.64,19.77 10.85,19.2 Q4.4
GLC
  Bottom 0.384: R31.P$1 16,36 D9.1 16.85,35.5 17.67,34.68 17.67,34.24 U7.18
GLC_D
  Bottom 0.384: Q6.4 14.03,35.83 R31.P$2 14.4,36.2 D9.2 15.17,34.73 D10.1
GND  (via drill 0.25, 0.4)
  Top 0.254: C32.P$2 C15.P$2 21.15,26.09 v21.17,26.11 22.09,27.03 C31.P$2 22.78,27.79 C30.P$2 | v19.8,20.4 20.42,20.4 R18.P$2 C28.P$2 | U3.49 v31.01,27.36
  Top 0.305: v41.99,14.41 41.95,14.37 U1.7 41.95,13.31 42.2,13.07 | 42.2,13.07 42.63,13.07 v42.69,13.01 | C3.P$2 40.1,14 41.03,13.07 42.2,13.07
  Top 0.384: v42,8.8 42,7.9 40.9,6.8 35.78,6.8 CAN1.3 35,6.1 33.24,4.34 19.64,4.34 v19.4,4.1
  Top 0.406: v31.9,19 C14.P$2 31.41,19.16 U4.2 | C8.P$2 v35,22.2 | C9.P$2 39.27,30.02 v39.27,29.74 | SWD.4 v41.76,33.75 v41.77,33.74 | C15.P$2 21.2,25.44 v21.2,25.02 | U4.8 24.97,18.02 v24.97,18.44
  Bottom 0.254: v22.27,36.54 22.27,35.91 U7.25 | U5.13 20.48,24.3 v21.2,25.02 | v24.97,18.44 23.01,20.4 v19.8,20.4 | R16.P$1 C27.P$2 35.34,18.7 35.15,18.51 35.05,18.51 v34.95,18.41 | R19.P$2 C29.P$2 v28.81,20.75 v28.8,20.76 | R3.P$1 29.47,30.06 v29.5,30.03 | C25.P$2 27.41,44.44 v26.97,44.44 | C26.P$2 31.49,44.44 v32.07,44.44 | C24.P$2 26.27,42.22 v26.27,41.04 | C18.P$2 10.85,44.55 v11.26,44.96 | C19.P$2 12.95,44.61 v12.58,44.98 | C21.P$2 18.35,44.46 v18.76,44.05 | C20.P$2 15.77,44.22 v15.64,44.22 | U6.4 29.28,39.28 v29.79,39.28
  Bottom 0.384: v19.4,4.1 17.2,6.3 CAN2.3
  Bottom 0.406: C38.P$1 v22.06,38.83 v22.07,38.84 | U5.5 27.45,22.35 v28.06,21.74
  other vias: 11.9,41.1 11.9,41.7 17.24,44.12 42.5,10.2 42.5,9.2 42,9.4 41.5,9 39.8,14.8 40.4,14.8 43.1,18.9 43.1,18.2 43.3,20.5 39.4,18.8 39.4,19.4 40.7,25.5 40.7,24.9 40.7,24.3 37.77,36.54 38.37,36.54 38.97,36.54 34.37,33.44 34.97,33.44 35.77,43.34 36.37,43.34 35.17,43.94 35.17,43.34 25.75,41.04 25.74,40.35 26.27,40.34 29.41,27.36 32.71,27.36 31.01,28.86 31.01,25.96 25.67,26.69 25.66,26.15
  pour Route2 (no thermals): 8.9,45.5 42,45.5 45.5,42 45.5,16.1 33.5,16.1 27.4,22.2 27.4,40.8 8.9,40.8
  pour Top (rank 2, no thermals): 9.9,42.5 12,42.5 12,40.5 9.9,40.5
  pour Bottom (no thermals): 17.1,44.4 19.9,44.4 19.9,43.7 17.1,43.7
  pour Top (no thermals): 41.3,11 42.9,11 42.9,8.3 41.3,8.3
  pour Top (no thermals): 39.6,15 40.6,15 40.6,13.8 39.6,13.8
  pour Top (no thermals): 43.1,20.7 43.7,20.7 43.7,17.8 42.9,17.8 42.9,19 43.1,19.2
  pour Top (no thermals): 39.2,19.5 40.2,19.5 40.2,18.6 39.2,18.6
  pour Top (no thermals): 40.4,25.8 41.9,25.8 41.9,24.1 40.4,24.1
  pour Route2 (no thermals): 37.9,16.6 45.5,16.6 45.5,8.5 41.2,8.5 41.2,9.3 37.9,12.6
  pour Top (no thermals): 37.5,36.9 39.3,36.9 39.3,35.3 37.5,35.3
  pour Top (no thermals): 34.1,33.7 35,33.7 35.2,33.5 35.2,32.6 34.5,32.6 34.1,33
  pour Bottom (no thermals): 33.9,44.3 36.9,44.3 36.9,43 33.9,43
  pour Route2 (no thermals): 21.6,41 23.5,41 23.5,36.1 21.6,36.1
  pour Top (no thermals): 25.5,42 26.6,42 26.6,39.9 25.6,39.9 25.5,40
  pour Top (no thermals): 25.3,26.9 25.8,26.9 25.8,24.7 25.3,24.7
  pour Route2 (no thermals): 19.7,25.1 28.1,25.1 28.1,21.3 27,20.2 19.7,20.2
  pour Route2 (no thermals): 25.4,27.1 28,27.1 28,24.5 25.3,24.5 25.3,27
  pour Route2 (no thermals): 23.5,20.9 26.4,20.9 26.5,21 26.5,18.4 23.6,18.4 23.6,20.8
I2C_PULLUP  (via drill 0.25, 0.35)
  Top 0.2: U3.41 35.15,26.63 35.16,26.64 35.76,26.64 v36.21,27.09
  Top 0.254: v36.5,28.1 v36.51,28.1 36.51,33.49 32.2,37.8 28.12,37.8 26.41,39.5 25.1,39.5 25.1,41.58 23.01,43.67 23.01,44.48 22.1,45.39 v22.1,45.47
  Bottom 0.254: v36.21,27.09 36.3,27.18 36.3,27.9 v36.5,28.1 | R7.P$1 12.55,42.9 11.5,42.9 10.95,43.45 R6.P$1 10.6,43.45 10.3,43.75 10.3,44.9 11.02,45.62 21.95,45.62 v22.1,45.47
LED1  (via drill 0.25)
  Top 0.254: U3.5 31.84,30.9 31.84,32.38 v31.79,32.38
  Bottom 0.254: v31.79,32.38 35.82,32.38 40.09,28.11 42.09,28.11 44.37,25.83 44.37,9.67 39,4.3 25.75,4.3 D1.CATHODE
LED2  (via drill 0.25)
  Top 0.254: U3.6 31.27,31.76 v31.33,31.82
  Bottom 0.254: v31.33,31.82 31.33,31.58 31.59,31.32 36.28,31.32 39.98,27.62 41.84,27.62 43.87,25.59 43.87,9.81 38.84,4.78 27.07,4.78 D2.CATHODE
MOTOR1
  Top 0.254: MOT1.P$1 29.36,34.73 30.27,33.83 U3.8
  Bottom 0.2: 26.84,34.74 U7.32
  Bottom 0.254: MOT1.P$1 28.73,35.1 27.2,35.1 26.84,34.74
MOTOR2  (via drill 0.25)
  Top 0.254: 28.65,32.95 27.44,34.16 v27.26,34.16 | U3.9 29.77,31.83 28.65,32.95 | 28.65,32.95 MOT2.P$1
  Bottom 0.2: v27.26,34.16 27.16,34.16 26.74,33.74 U7.34
MOTOR3  (via drill 0.25)
  Top 0.254: U3.10 29.27,31.7 27.67,33.3 27.64,33.33 | 27.64,33.33 27.57,33.4 26.63,33.4 v26.48,33.25 | 27.64,33.33 MOT3.P$1
  Bottom 0.2: v26.48,33.25 26.45,33.25 25.94,32.74
  Bottom 0.254: 25.94,32.74 U7.36
MOTOR_ENABLE  (via drill 0.25)
  Top 0.254: v26.25,36.41 26.71,35.95 30.4,35.95 32.77,33.58 U3.3
  Bottom 0.2: U7.31 25.4,35.56 v26.25,36.41
MOTOR_FAULT  (via drill 0.25)
  Top 0.254: R26.P$2 22.6,39.9 v22.6,39.3 | v30.8,36.4 33.27,33.93 U3.2
  Bottom 0.2: U7.26 22.75,38.45 22.75,39.15 v22.6,39.3
  Bottom 0.254: 22.75,38.45 22.92,38.62 25.82,38.62 27,39.8 27,40.6 30.8,40.6 v30.8,36.4
MOTOR_HIZ  (via drill 0.25)
  Top 0.254: v26.5,34.26 26.5,34.76 27.28,35.54 30.03,35.54 32.31,33.26 32.31,30.87 U3.4
  Bottom 0.2: U7.37 25.16,32.24 24.83,32.58 24.83,32.9 25.16,33.24 | U7.35 25.16,33.24 | 25.16,33.24 24.83,33.58 24.83,33.9 25.16,34.24 U7.33 26.48,34.24 v26.5,34.26
N$1
  Top 0.406: R1.P$1 C1.P$1 43.32,3.32 M3.P$1
N$2
  Bottom 0.254: U7.40 25.53,30.74 C36.P$2
N$3  (via drill 0.25)
  Top 0.254: v16.8,42 16.68,41.38 AUX2.3
  Bottom 0.254: R4.P$1 16.8,42.05 v16.8,42
N$4
  Top 0.305: C3.P$1 40.18,12.57 42.23,12.57 42.45,12.35 U1.3
N$5
  Top 0.61: L2.2 40.7,20.75 U2.5
N$6  (via drill 0.25)
  Top 0.254: AUX2.4 15.1,41.6 v15.53,42.03
  Bottom 0.254: v15.53,42.03 15.21,42.35 R5.P$1
N$7  (via drill 0.25)
  Top 0.254: AUX2.6 12.6,41.93 v12.42,42.11
  Bottom 0.254: v12.42,42.11 12.24,42.11 R8.P$1 R6.P$2
N$8  (via drill 0.25)
  Top 0.254: v14.43,42.01 13.85,41.7 AUX2.5
  Bottom 0.254: R7.P$2 R9.P$1 14.44,42.35 v14.43,42.01
N$9  (via drill 0.25)
  Top 0.254: v33.23,42.25 33.07,42.09 33.07,40.99 AUX1.3
  Bottom 0.254: v33.23,42.25 R10.P$1
N$10
  Bottom 0.254: C35.P$2 25.31,29.51 24.75,30.07 U7.1
N$11  (via drill 0.25)
  Top 0.254: v31.85,42.27 31.85,40.76 AUX1.4
  Bottom 0.254: v31.85,42.27 31.83,42.25 R11.P$1
N$12  (via drill 0.25)
  Top 0.254: v30.61,42.26 30.61,41.19 AUX1.5
  Bottom 0.254: v30.61,42.26 v30.6,42.26 30.59,42.25 R12.P$1
N$13
  Bottom 0.22: C35.P$1 25.31,28.09 24.55,28.66
  Bottom 0.254: U7.2 24.25,29.81 24.55,29.51 24.55,28.66
N$14
  Bottom 0.3: U7.5 22.79,30.09
  Bottom 0.384: 22.79,30.09 22.79,29.36 C34.P$2
N$15  (via drill 0.25)
  Top 0.254: v29.32,42.29 29.17,42.14 29.17,40.98 AUX1.6
  Bottom 0.254: v29.32,42.29 28.84,42.29 R13.P$1
N$16
  Bottom 0.254: U7.38 26.36,31.74 26.38,31.72 C37.P$2
N$17
  Bottom 0.384: D1.ANODE 24.4,7.75 24.45,7.8 24.42,7.93 R20.P$2
N$18
  Bottom 0.384: R21.P$2 26.2,7.68 26.23,7.67 26.2,7.65 D2.ANODE
N$19  (via drill 0.25)
  Top 0.254: v27.9,42.2 27.9,41.12 AUX1.7
  Bottom 0.254: R14.P$1 27.45,42.2 v27.9,42.2
NRST  (via drill 0.25)
  Top 0.254: U3.7 30.77,32.09 v31.75,33.07 | v39,31.8 39.08,31.72 C9.P$1 39.74,30.65 40.5,30.65 SWD.2
  Bottom 0.254: v31.75,33.07 31.92,32.9 37.9,32.9 v39,31.8
PRIMARY_CS  (via drill 0.25)
  Top 0.254: U3.19 v26.88,27.13 v26.88,27.14 | v32.12,39.56 31.54,39.56 31.14,39.96 31.14,43.04 v31.9,43.8
  Bottom 0.254: v26.88,27.14 27.34,27.14 30.05,29.85 30.05,33.53 32.12,35.59 v32.12,39.56 | R11.P$2 31.45,43.35 v31.9,43.8
PRIMARY_EXTRA  (via drill 0.25)
  Top 0.254: U3.24 27,24.63 26.64,24.27 24.13,24.27 v23.9,24.5 | v34.2,39 33.3,39.9 32.5,39.9 32.39,40.01 32.39,42.29 32.8,42.7 v32.8,44.1
  Bottom 0.254: v32.8,44.1 32.7,44 R10.P$2 | v23.9,24.5 v23.91,24.5 24.82,25.41 25.16,25.41 25.32,25.57 25.32,25.6 25.36,25.64 25.87,25.64 26.2,25.98 26.2,26.62 27.46,26.62 30.46,29.62 30.46,33.36 34.2,37.1 v34.2,39
SHA
  Bottom 0.2: Q2.5 5.65,13.01 11.52,13.01 11.91,13.4 13.44,13.4 15.39,15.35 17,15.35 18.55,16.9 18.55,25.58 20.16,27.2 21.4,27.2 21.75,27.55 U7.7
  pour Bottom (isolate 0.4, no thermals): 5.6,18.6 0.3,18.6 0.3,8.2 5.6,8.2
SHB
  Bottom 0.2: 5.51,24.68 6.22,23.98 11.68,23.98 11.7,24 11.7,25.9 12.8,27 12.8,27.56 15.34,30.1 15.5,30.1 17.64,32.24 U7.14
  Bottom 0.254: Q3.1 5.51,24.68
  pour Bottom (isolate 0.4, no thermals): 5.6,27.8 0.2,27.8 0.2,19.1 5.6,19.1
SHC
  Bottom 0.2: 7.38,37.27 9.51,35.14 13.76,35.14 14.71,34.19 16.61,34.19 17.06,33.74 U7.17
  Bottom 0.254: Q6.PAD 7.38,37.27
  pour Bottom (isolate 0.4, no thermals): 5.6,40 0.3,40 0.3,29.6 5.6,29.6
SWCLK
  Top 0.254: U3.37 34.76,24.34 35.88,24.34 36.64,25.1 37.5,25.1 38.4,26 38.4,33.2 39.85,34.65 SWD.5
SWDIO
  Top 0.254: U3.36 33.84,23.86 36,23.86 36.84,24.69 37.67,24.69 38.89,25.91 38.89,27.59 39.3,28 41.7,28 41.7,31.35 40.8,32.25 SWD.3
SXA_N
  Bottom 0.2: SH1.1 13.72,17.49 15.59,17.49 17.19,19.09 17.19,26.29 18.5,27.6 18.5,28.8 19.48,29.78 20.25,29.78 U7.10
SXA_P
  Bottom 0.2: 13.39,16.46 13.39,16.97 13.51,17.09 15.75,17.09 17.57,18.91 17.57,26.17 18.9,27.5 18.9,28.7 19.6,29.4 20.44,29.4 20.75,29.71 U7.9
  Bottom 0.254: RA.2 13.39,16.46
  pour Bottom (isolate 0.4, no thermals): 16.9,17.8 15.9,16.8 14.5,16.8 12.4,16.8 12.4,15.3 13.7,15.3 13.9,15.3 14.8,16.2 16.4,16.2 17.4,17.2 16.9,17.7
  pour Bottom (isolate 0.4, no thermals): 10,18.6 11.4,18.6 11.4,16.7 13.5,16.7 13.5,15.2 10,15.2
SXB_N
  Bottom 0.2: SH2.1 14.08,23.88 14.15,23.95 14.15,25.75 14.15,26.45 16.15,28.45 16.15,28.8 18.1,30.74 U7.11
SXB_P
  Bottom 0.2: 13,23.3 13.5,23.3 13.7,23.5 13.7,24.04 13.77,24.1 13.77,26.56 15.8,28.6 15.8,28.94 18.1,31.24 U7.12
  Bottom 0.254: RB.2 13,23.3
  pour Bottom (isolate 0.4, no thermals): 13.4,25.6 12.4,25.6 12.4,24.5 11.6,23.7 11.6,21.8 13.2,21.8 13.2,23.9 13.4,24.1
  pour Bottom (no thermals): 12.1,23.7 9.9,23.7 9.9,20.4 10.7,20.4 12,21.7 12,23.6
SXC_N
  Bottom 0.2: SH3.1 13.94,37.67 13.94,37.46 14.08,37.32 17.12,37.32 18.68,35.76 18.68,35.24 U7.20
SXC_P
  Bottom 0.2: 12.77,38.6 13.57,37.8 13.57,37.31 13.92,36.96 16.94,36.96 18.3,35.6 18.3,34.74 U7.19
  Bottom 0.254: RC.2 12.77,38.6
  pour Bottom (isolate 0.4, no thermals): 13,40.9 10.1,40.9 10.1,36.7 13,36.7
  pour Bottom (no thermals): 11.2,42 9.2,42 9.2,40.4 9.8,40.4 10.1,40.1 10.1,39.2 11.3,39.2 11.3,41.9
V+  (via drill 0.25)
  Route2 2.54: J2.1 J1.1 20.14,14.56 v19.76,14.56
  Bottom 0.2: U7.4 U7.3
  Bottom 0.254: Q1.5 9.91,11.79 v9.9,11.8 | Q1.6 v9.9,10.5 | Q1.7 9.92,9.22 v9.9,9.2 | Q1.8 9.94,7.93 v9.9,7.9 | Q3.5 9.91,28.52 v9.9,28.5 | Q3.6 9.97,27.23 v9.9,27.3 | Q3.7 9.95,25.95 v9.9,25.9 | Q3.8 9.96,24.66 v9.9,24.6 | Q5.8 9.94,30.07 v9.9,30.1 | Q5.7 9.95,31.35 v9.9,31.3 | Q5.6 9.93,32.63 v9.9,32.6 | Q5.5 9.98,33.91 v9.9,34 | Q5.PAD 8.46,31.56 v8.2,31.3 | Q3.PAD 8.46,26.16 v8.2,25.9 | Q1.PAD 8.2,10.12 v8.2,10.5 | R15.P$2 32.87,15.37 J2.1
  Bottom 0.34: C33.P$1 23.81,28.95 | C34.P$1 23.01,28.15
  Bottom 0.384: U7.3 23.75,29.06 C33.P$1
  Bottom 0.4: 23.81,28.95 23.01,28.15
  other vias: 7.64,41.89 7.64,41.31 7.64,40.74 7.3,34 8.2,34 7.3,30.1 8.2,30.1 7.3,31.3 9,34 9.1,31.3 9.1,30.1 9,32.6 15.26,25.37 15.26,24.81 15.27,24.24 14.75,25.39 14.75,24.82 14.76,24.23 20.06,14.97 20.66,14.97 20.36,14.56 20.06,14.15 19.46,14.15 19.76,13.65 19.06,13.65 12.36,8.75 12.96,8.75 13.56,8.75 12.36,7.35 12.96,7.35 13.56,7.35 13.86,8.05 14.26,8.75 14.96,8.75 14.56,8.05 14.26,7.35 14.96,7.35 14.56,6.85 13.86,6.85 13.16,6.85 12.56,6.85 17.87,28.61 17.52,28.24 17.91,27.92 17.44,27.73 16.92,28.64 17.02,28.14 17.24,27.26 9.1,28.5 8.2,28.5 7.3,28.5 9.1,27.3 8.2,27.3 7.3,27.3 9.1,25.9 7.3,25.9 9.1,24.6 8.2,24.6 7.3,24.6 9.1,11.8 8.2,11.8 7.3,11.8 9.1,10.5 7.3,10.5 9.1,9.2 8.2,9.2 7.3,9.2 9.1,7.9 8.2,7.9 7.3,7.9 22.31,26.42 23.31,26.42 23.31,25.82 22.31,25.82 39.4,10.6 40,10.6 40.51,10.6 19.14,39.29 19.14,38.78 19.14,38.27 19.05,37.74 19.66,39.5 20.17,39.5 6.09,41.89 6.09,41.33 6.07,40.69 27.86,14.17 28.46,14.47 27.86,13.47 28.46,13.87 28.46,13.17 23.86,14.27 24.56,14.27 23.86,13.67 24.56,13.67 23.86,13.07 24.56,13.07 23.86,12.47 24.56,12.47 23.86,11.87 24.56,11.87 8.2,32.6 7.3,32.6
  pour Route15 (isolate 0.5, rank 2, no thermals): 0.5,41.4 26.2,41.4 26.2,17.7 28.9,15 45.5,15 45.5,4 42,0.5 4,0.5 0.5,4
  pour Bottom (rank 2, no thermals): 21.5,40.6 18.7,40.6 18.7,37.3 21.5,37.3
  pour Bottom (isolate 0.4, no thermals): 16.3,25.6 14.6,25.6 14.6,24 16.3,24
  pour Bottom (no thermals): 21.9,15.8 18.9,15.8 17.9,14.8 17.9,14.6 18.6,13.9 18.6,12.8 19.8,11.6 23.1,11.6 23.1,14.6
  pour Bottom (isolate 0.4, no thermals): 15.5,9.1 12.1,9.1 12.1,6.5 15.5,6.5
  pour Bottom (isolate 0.4, no thermals): 18.3,29.9 17.8,29.9 17.2,29.3 17.2,29.2 16.4,28.4 16.4,26.9 17.4,26.9 18.2,27.7 18.2,29.8
  pour Top (isolate 0.5, rank 2, no thermals): 10.9,39.5 4.9,39.5 4.9,8 4.8,7.9 9.9,7.9 10.9,8.9
  pour Bottom (isolate 0.3, no thermals): 22.6,28.1 23.1,28.1 23.2,28 23.2,26.9 23.6,26.5 23.6,25.4 21.8,25.4 21.8,26.1 22.6,26.9
  pour Top (isolate 0.5, no thermals): 16.2,9.3 18.9,12 18.9,13.9 19.5,14.5 31.2,14.5 32,13.7 32,11 25.6,11 19.2,4.6 4.9,4.6 4.9,9.3
  pour Top (isolate 0.4, no thermals): 39.1,11.9 42.1,11.9 42.1,11.4 40.8,11.4 40.8,10.3 39.1,10.3
  pour Bottom (no thermals): 8,42.2 5.9,42.2 5.8,42.1 5.8,40.5 8,40.5
  pour Top (isolate 0.5, rank 2, no thermals): 0.4,39.5 9.7,39.5 9.7,7.6 0.3,7.6 0.3,39.4
V-  (via drill 0.25)
  Top 0.406: v42.8,7.2 43.02,7.2 C1.P$2 R1.P$2
  Route15 2.54: J2.2 32.08,9.58 19.82,9.58 16.7,12.7 J1.2 14.94,11.24 v13.89,11.24 12.69,11.24 v12.19,11.74
  Bottom 0.254: v13.89,18.63 13.52,18.26 13.36,18.26 13.73,18.63 v13.89,18.63 | SH1.2 v13.88,18.63 v13.89,18.63 | SH3.2 14.53,38 15.2,38 RC.1 | U7.PAD U7.P14 | U7.P8 23.25,31.24 U7.39 26.27,31.24 C37.P$1 27.68,29.83 C36.P$1
  Bottom 0.384: v14.28,22.72 14.28,22.77 14.54,23.03 14.54,23.3 SH2.2
  other vias: 14.12,39.3 14.11,38.78 16.22,38.51 18.02,37.72 18.04,39.04 17.64,38.72 17.64,38.06 18.03,38.39 16.22,39.03 16.49,39.47 16.12,23.49 16.12,22.98 16.11,22.45 13.75,22.2 11.99,20.74 12.59,20.74 13.19,20.74 12.89,21.15 12.29,21.15 14.29,22.21 14.28,21.67 13.76,21.65 13.53,21.15 14.06,21.2 16.15,21.91 15.99,19.04 15.39,19.04 14.79,19.04 14.19,19.04 15.69,18.63 15.09,18.63 14.49,18.63 15.39,18.22 14.79,18.22 14.19,18.22 12.62,17.59 12.1,17.59 15.69,19.45 16.29,19.45 15.09,19.45 14.49,19.45 14.89,10.15 12.49,10.14 13.09,10.14 14.09,10.65 13.69,10.14 13.89,11.84 14.39,11.54 14.29,10.14 14.69,10.65 14.39,12.24 14.99,11.84 14.99,11.14 14.91,12.54 14.81,31.35 14.21,31.35 14.51,30.94 13.91,30.94 14.21,30.53 14.81,30.53 14.11,30.02 13.71,29.52 13.29,11.74 12.74,11.73 15.76,33.16 14.71,33.14 23.81,27.15 24.12,26.74 24.12,26.19 24.13,25.64 39.3,8.7 39.9,8.7 40.5,8.7 39.3,8.1 39.9,8.1 40.5,8.1 1.01,39.32 1.71,39.32 2.41,39.32 3.11,39.32 1.31,38.72 2.11,38.72 2.81,38.72 1.01,38.12 1.71,38.12 2.41,38.12 1.31,37.52 2.11,37.52 16.99,11.04 17.69,11.04 18.39,11.04 16.99,10.34 17.69,10.34 18.39,10.34 23.39,10.64 24.19,10.64 22.59,9.94 23.39,9.94 24.19,9.94 28.19,10.64 29.09,10.64 29.99,10.64 28.19,9.94 29.09,9.94 29.99,9.94 32.89,13.54 33.59,13.54 33.59,12.94 32.89,12.94 32.89,12.34 33.59,12.34 32.89,11.74 33.59,11.74 1.01,36.92 22.99,17.25 22.39,17.25 22.39,16.65 22.99,16.65 22.39,16.05 22.99,16.05 21.79,17.25 21.79,16.65 21.79,16.05 21.79,17.85 22.39,17.85 1.31,39.92 2.11,39.92 1.01,40.52 15.13,35.68 12.03,32.35 11.79,31.88 11.81,30.48 11.8,27.69 11.8,27.18 11.79,26.67 11.8,28.2 16.63,36.28 17.23,35.98 11.79,32.83 13.03,26.5
  pour Route2 (isolate 0.5, rank 2, no thermals): 0.5,40 26.2,40 26.2,21.3 32.2,15.3 45.5,15.3 45.5,4 42,0.5 4,0.5 0.5,4
  pour Bottom (isolate 0.4, rank 3, no thermals): 18.5,39.6 13.4,39.6 13.4,38.4 13.6,38.2 14.7,38.2 14.7,38 16.1,36.6 18.5,36.6
  pour Bottom (isolate 0.4, rank 2, no thermals): 16.3,23.6 13.9,23.6 13.9,23.5 13.3,22.9 13.3,21.7 12.2,21.7 11.5,21 11.5,19.8 14.2,19.8 16.3,21.9
  pour Bottom (isolate 0.4, rank 2, no thermals): 16.8,20 14.3,20 13.9,19.6 11.8,19.6 11.8,17 12.9,17 12.9,18.2 13.5,18.2 13.9,17.8 15.2,17.8 16.8,19.4
  pour Bottom (isolate 0.4, no thermals): 18,12.2 18,13.2 16.96,14.24 15.94,14.24 13.4,11.7 13.4,11.6 12,11.6 12,9.9 15.7,9.9
  pour Bottom (isolate 0.4, no thermals): 16.9,32.3 14.6,32.3 14.3,32 13.4,31.1 13.4,28.7 16.9,32.2
  pour Top (isolate 0.5, no thermals): 18.3,13.33 18.3,39.7 11.5,39.7 11.5,9.7 14.9,9.7
  pour Bottom (no thermals): 12,12.9 14.7,12.9 13.2,11.4 12,11.4
  pour Bottom (isolate 0.2, no thermals): 14.5,33.4 16,33.4 16,32.8 14.5,32.8
  pour Bottom (isolate 0.3, rank 2, no thermals): 23.4,27.5 24.2,27.5 25,26.7 25,26.6 25,25.9 24.5,25.4 23.9,25.4 23.9,26.7 23.4,27.2
  pour Top (isolate 0.5, rank 2, no thermals): 17.1,19.5 23.5,19.5 34.2,17.2 37.1,13.9 37.1,11.4 36.7,11 33.2,11 32.4,11.8 32.4,13.7 31.3,14.8 17.7,14.8 17.1,15.4
  pour Top (isolate 0.5, no thermals): 39.1,9.9 40.8,9.9 40.8,7.7 39.1,7.7
  pour Route15 (isolate 0.5, no thermals): 0.5,40 6.3,40 6.3,26.2 0.4,26.2 0.4,39.9
  pour Bottom (isolate 0.5, rank 3, no thermals): 15.8,14.4 37.3,14.4 37.3,9.5 15.8,9.5
  pour Top (isolate 0.5, no thermals): 0.3,42 9.8,42 14.2,37.6 14.18,34.4 11.93,34.37 10.9,35.4 5.4,35.4 4.3,36.5 0.3,36.5
  pour Route2 (isolate 0.5): 0.6,38.2 0.6,41.8 6.1,45.5 8.4,45.5 8.4,38.2
VBAT_SENSE  (via drill 0.4)
  Top 0.254: U3.31 31.27,22.64 v31.47,22.43
  Bottom 0.254: v31.47,22.43 31.3,22.26 31.3,20.7 33.01,18.99 33.01,18.85 R15.P$1 33.06,18.71 R16.P$2 C27.P$1
VSW
  Top 0.305: U1.8 41.45,16.27 L1.2
VTEMP_FET  (via drill 0.25, 0.4)
  Top 0.2: v12.1,37.2 13.16,38.26 13.16,42.15 13.61,42.6 16.08,42.6 16.09,42.59 16.37,42.87 18.55,42.87 19.81,41.61 20.6,41.61 20.89,41.33 20.89,38.3 20.69,38.1 20.11,38.1 18.19,36.19 18.19,29.87 18.51,29.54 18.51,23.27 19.68,22.11 21.2,22.11 21.61,21.7 C28.P$1
  Top 0.254: v22.3,21.1 21.68,20.48 R18.P$1 C28.P$1 | v25.01,23.71 25.09,23.79 28.13,23.79 U3.25
  Bottom 0.2: v12.1,37.2 12.01,37.11 R17.P$2
  Bottom 0.254: v22.3,21.1 23.6,21.1 23.6,23.99 24.73,23.99 v25.01,23.71
VTEMP_MOT  (via drill 0.4)
  Top 0.254: U3.30 30.77,22.67 v30.6,22.5 | v40.9,26.8 41.7,26.8 42.6,27.7 42.6,38.4 TEMP2.P$1
  Bottom 0.254: C29.P$1 R19.P$1 30.6,22.05 v30.6,22.5 31.12,23.02 35.38,23.02 35.9,22.5 35.9,21.4 36.5,20.8 36.5,17.3 37.1,16.7 38,16.7 38.83,17.53 38.83,24.83 40.8,26.8 v40.9,26.8

## Text on the board
tPlace: G | D | C | B | A | 3 | 5 | G | E | D | C | B | A | 3 | 5 | C | V- | B | V+ | A
tNames: 1 | 2 | 3 | D | R | 5 | T | G | 3
_tNames: moteus hp r1 | (c) 2022